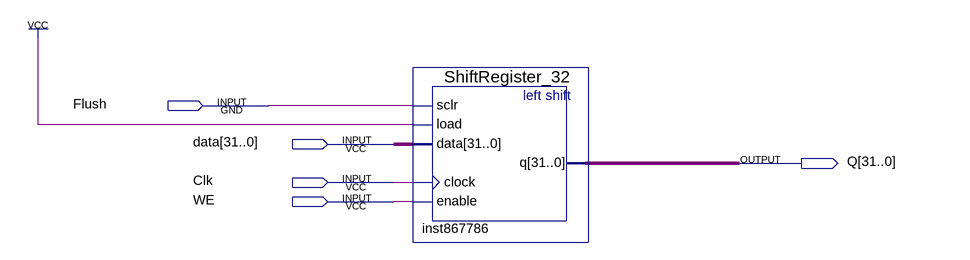
[diagram p0: schematic sheet]
// Quartus schematic ShiftRegister32.bdf as structural Verilog: 1 symbols, 5 pins
module ShiftRegister32 (
  input  Flush,
  input  [31:0] data,
  input  Clk,
  input  WE,
  output [31:0] Q
);

  ShiftRegister_32 inst867786 (.sclr(Flush), .load(1'b1), .data(data), .clock(Clk), .enable(WE), .q(Q));
endmodule
